# Altium schematic sheet HoloCubicPowerV02_220109.SchDoc
size A4
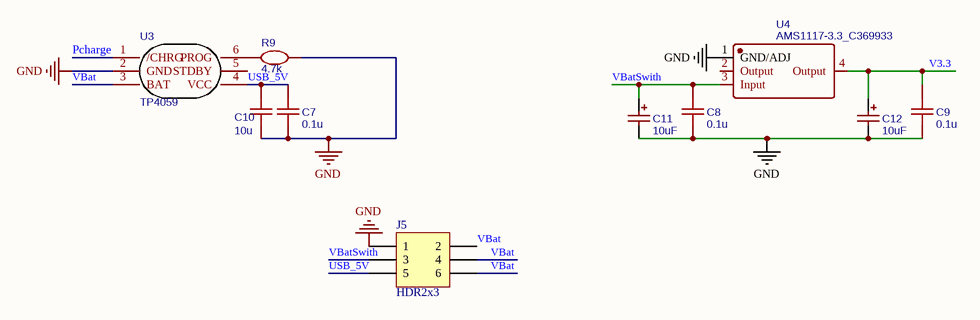
[diagram p0: HoloCubicPowerV02_220109.SchDoc]

## Parts
C7  0.1u  [C0603]
C8  0.1u  [C0603]
C9  0.1u  [C0603]
C10  10u  [C0603]
C11  10uF  [CAP-SMD_L3.2-W1.6-R-RD]
C12  10uF  [CAP-SMD_L3.2-W1.6-R-RD]
J5  HDR2x3  [PIN-2x3-2.54-1.0]
R9  4.7k  [R0603]
U3  TP4059  [SOT-23-6]
U4  AMS1117-3.3_C369933  [SOT-223-4_L6.5-W3.5-P2.30-LS7.0-BR]

## Nets
GND: C7.1 C8.1 C9.1 C10.1 C11.2 C12.2 J5.1 R9.1 U3.2(GND) U4.1(GND/ADJ)
Pcharge: U3.1(/CHRG)
USB_5V: C7.2 C10.2 J5.5 U3.4(VCC)
V3.3: C9.2 C12.1 U4.4(Output)
VBat: J5.2 J5.4 J5.6 U3.3(BAT)
VBatSwith: C8.2 C11.1 J5.3 U4.3(Input)
NetR9_2: R9.2 U3.6(PROG)

Not connected (* = marked no-connect by the designer): U3 5(STDBY); U4 2(Output)

## Library data of the parts
C7-C10 = 0.1u: nameAlias: Value(F); Contributor: LCEDA_Lib; spicePre: C; spiceSymbolName: C_0603_US
C11 C12 = 10uF: BOM_Manufacturer: CEC; BOM_Manufacturer Part: CA45-A-16V-10uF-K; nameAlias: Capacitance; Contributor: LCSC; BOM_Supplier: LCSC; BOM_Supplier Part: C128254; BOM_JLCPCB Part Class: Extended Part; spicePre: C; spiceSymbolName: CA45-A-16V-10UF-K
J5 = HDR2x3: Connector
R9 = 10k: Contributor: LCEDA_Lib; spicePre: R; spiceSymbolName: R_0603_EU
U3 = TP4059: BOM_Manufacturer: TOPPOWER; BOM_Supplier: LCSC; BOM_Manufacturer Part: TP4059; BOM_Supplier Part: C80364; BOM_JLCPCB Part Class: Extended Part; spicePre: U; spiceSymbolName: TP4059
U4 = AMS1117-3.3_C369933: BOM_Manufacturer: KEXIN; Contributor: LCSC; BOM_Supplier: LCSC; BOM_Supplier Part: C369933; BOM_Manufacturer Part: AMS1117-3.3; BOM_JLCPCB Part Class: Extended Part; spicePre: U; spiceSymbolName: AMS1117-3.3_C369933